# Altium schematic sheet DC_DC.SchDoc
size A4; SheetNumber: 1; SheetTotal: 1
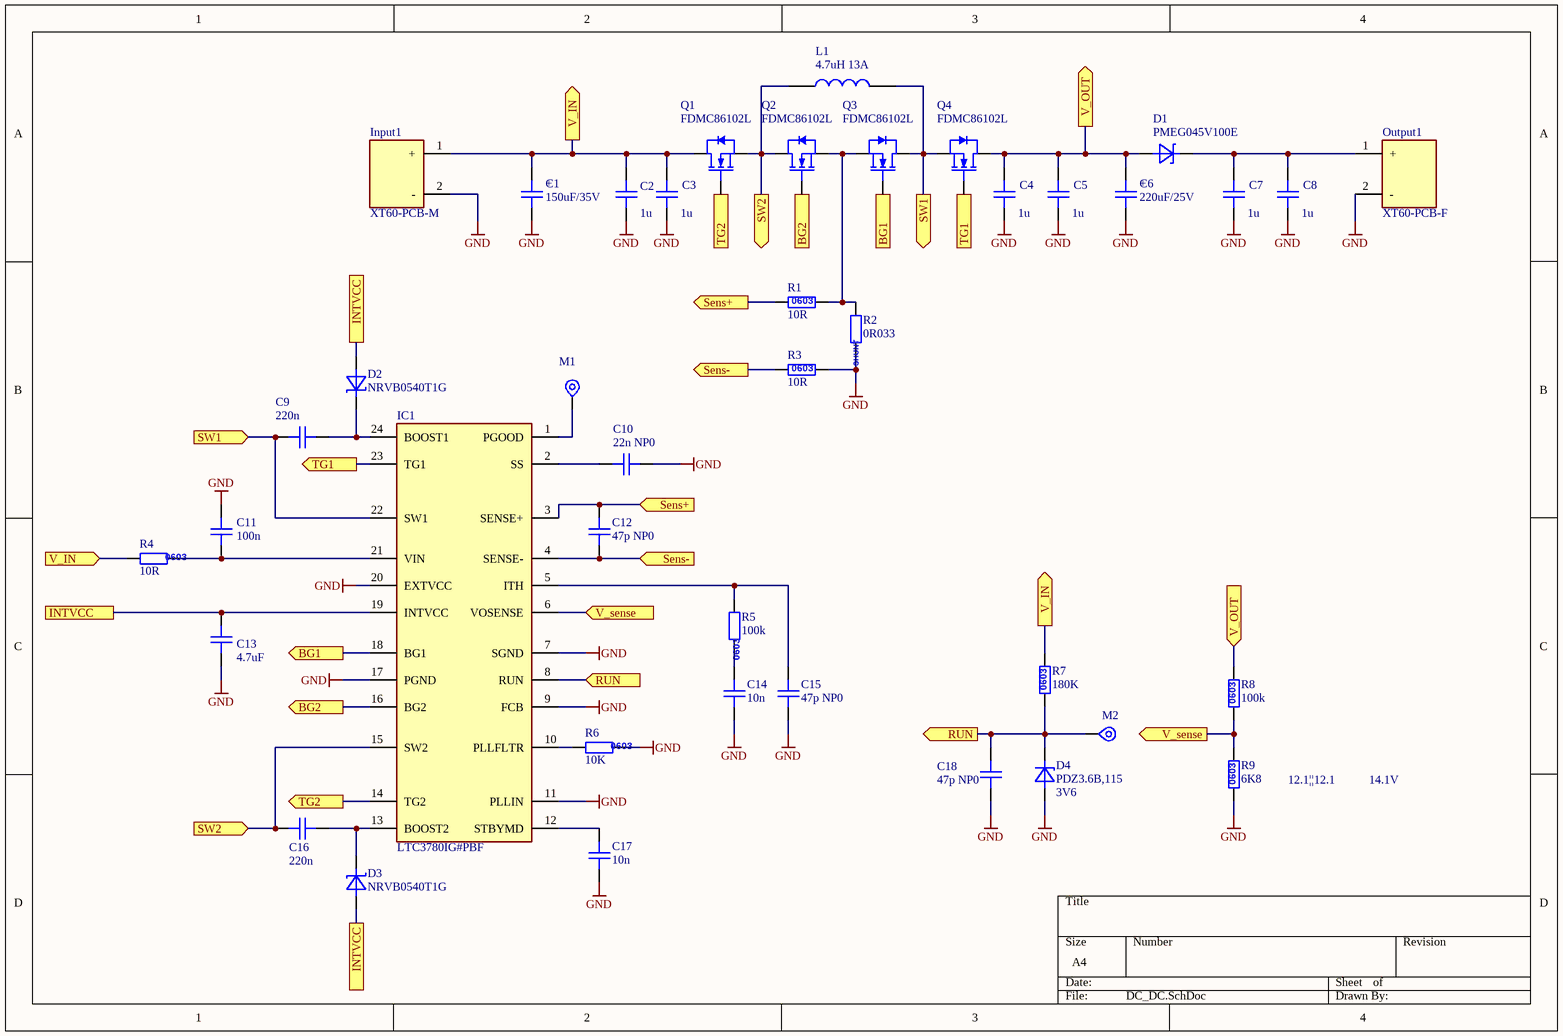
[diagram p0: DC_DC.SchDoc]

## Parts
C1  value 150uF/35V  [PZF8x9]  (hidden comment: 35PZE150M8X9)
C2  value 1u  [C1206_medium]  (hidden comment: C1206C105K5RACTU)
C3  value 1u  [C1206_medium]  (hidden comment: C1206C105K5RACTU)
C4  value 1u  [C1206_medium]  (hidden comment: C1206C105K5RACTU)
C5  value 1u  [C1206_medium]  (hidden comment: C1206C105K5RACTU)
C6  value 220uF/25V  [PZF8x9]  (hidden comment: 25PZF220M8X9)
C7  value 1u  [C1206_medium]  (hidden comment: C1206C105K5RACTU)
C8  value 1u  [C1206_medium]  (hidden comment: C1206C105K5RACTU)
C9  value 220n  [C1206_thin]  (hidden comment: C1206C224J1RACAUTO)
C10  value 22n NP0  [C0603]  (hidden comment: AC0603KRX7R9BB223)
C11  value 100n  [C1206_thin]  (hidden comment: GRT31C5C2A104JA12L)
C12  value 47p NP0  [C0603]  (hidden comment: GCM1885C2A470JA16J)
C13  value 4.7uF  [C1206_thick]  (hidden comment: GRM31CC72A475ME11L)
C14  value 10n  [C0603]  (hidden comment: C0603X103K1RAC3316)
C15  value 47p NP0  [C0603]  (hidden comment: GCM1885C2A470JA16J)
C16  value 220n  [C1206_thin]  (hidden comment: C1206C224J1RACAUTO)
C17  value 10n  [C0603]  (hidden comment: C0603X103K1RAC3316)
C18  value 47p NP0  [C0603]  (hidden comment: GCM1885C2A470JA16J)
D1  value PMEG045V100E  [SOT1289]  (hidden comment: PMEG045V100EIPE-QZ)
D2  NRVB0540T1G  [SOD323]
D3  NRVB0540T1G  [SOD323]
D4  PDZ3.6B,115  value 3V6  [SOD323]
IC1  LTC3780IG#PBF  [SOP65P780X200-24N]
Input1  XT60-PCB-M  [XT60-PCB-M]
L1  value 4.7uH 13A  [WE-HCI]  (hidden comment: 7443551470)
M1  TP  [Pad 1mm SMD]  (value not drawn)  (no BOM)
M2  TP  [Pad 1mm SMD]  (value not drawn)  (no BOM)
Output1  XT60-PCB-F  [XT60-PCB-F]
Q1  FDMC86102L  [PowerPak1212_LFPAK33]
Q2  FDMC86102L  [PowerPak1212_LFPAK33]
Q3  FDMC86102L  [PowerPak1212_LFPAK33]
Q4  FDMC86102L  [PowerPak1212_LFPAK33]
R1  value 10R  [R0603]  (hidden comment: CR0603-FX-10R0ELF)
R2  value 0R033  [Shunt_2512]  (hidden comment: GMR100HTBFMR033)
R3  value 10R  [R0603]  (hidden comment: CR0603-FX-10R0ELF)
R4  value 10R  [R0603]  (hidden comment: CR0603-FX-10R0ELF)
R5  value 100k  [R0603]  (hidden comment: RC0603FR-07100KL)
R6  value 10K  [R0603]  (hidden comment: CRGP0603F10K)
R7  value 180K  [R0603]  (hidden comment: CRGCQ0603F180K)
R8  value 100k  [R0603]  (hidden comment: RC0603FR-07100KL)
R9  value 6K8  [R0603]  (hidden comment: CRGCQ0603F6K8)

## Ports
BG1 (in, see DC_DC[1C]), BG1 (out, see DC_DC[3A]), BG2 (in, see DC_DC[1C]), BG2 (out, see DC_DC[3A]), INTVCC (see DC_DC[1B], DC_DC[1C]), INTVCC (see DC_DC[1B], DC_DC[1D]), INTVCC (see DC_DC[1C], DC_DC[1D]), RUN (in, see DC_DC[3C]), RUN (out, see DC_DC[2C]), Sens+ (in, see DC_DC[2B]), Sens+ (out, see DC_DC[2B]), Sens- (in, see DC_DC[2B]), Sens- (out, see DC_DC[2C]), SW1 (in, see DC_DC[3A]), SW1 (out, see DC_DC[1B]), SW2 (in, see DC_DC[2A]), SW2 (out, see DC_DC[1D]), TG1 (in, see DC_DC[1B]), TG1 (out, see DC_DC[3A]), TG2 (in, see DC_DC[1D]), TG2 (out, see DC_DC[2A]), V_IN (in, see DC_DC[2A], DC_DC[3C]), V_IN (out, see DC_DC[1C], DC_DC[2A]), V_IN (out, see DC_DC[1C], DC_DC[3C]), V_OUT (in, see DC_DC[3A]), V_OUT (out, see DC_DC[4C]), V_sense (in, see DC_DC[3C]), V_sense (out, see DC_DC[2C])

## Nets
GND: C1.2 C2.1 C3.1 C4.1 C5.1 C6.2 C7.1 C8.1 C10.1 C11.2 C13.2 C14.1 C15.1 C17.2 C18.1 D4.1(A) IC1.7(SGND) IC1.9(FCB) IC1.11(PLLIN) IC1.17(PGND) IC1.20(EXTVCC) Input1.2(-) Output1.2(-) R2.1 R3.1 R6.2 R9.2
BG1: IC1.18(BG1) Q3.4(GATE) ; port BG1
BG2: IC1.16(BG2) Q2.4(GATE) ; port BG2
INTVCC: C13.1 D2.1(A) D3.1(A) IC1.19(INTVCC) ; port INTVCC
RUN: C18.2 D4.2(C) IC1.8(RUN) M2.1 R7.2 ; port RUN
Sens+: C12.2 IC1.3(SENSE+) R1.2 ; port Sens+
Sens-: C12.1 IC1.4(SENSE-) R3.2 ; port Sens-
SW1: C9.2 IC1.22(SW1) L1.1 Q3.5(DRAIN) Q4.1,_2,_3(SOURCE) ; port SW1
SW2: C16.2 IC1.15(SW2) L1.2 Q1.1,_2,_3(SOURCE) Q2.5(DRAIN) ; port SW2
TG1: IC1.23(TG1) Q4.4(GATE) ; port TG1
TG2: IC1.14(TG2) Q1.4(GATE) ; port TG2
V_IN: C1.1 C2.2 C3.2 Input1.1(+) Q1.5(DRAIN) R4.1 R7.1 ; port V_IN
V_OUT: C4.2 C5.2 C6.1 D1.1,_2(A) Q4.5(DRAIN) R8.1 ; port V_OUT
V_sense: IC1.6(VOSENSE) R8.2 R9.1 ; port V_sense
NetC7_2: C7.2 C8.2 D1.3(K) Output1.1(+)
NetC9_1: C9.1 D2.2(C) IC1.24(BOOST1)
NetC10_2: C10.2 IC1.2(SS)
NetC11_1: C11.1 IC1.21(VIN) R4.2
NetC14_2: C14.2 R5.2
NetC15_2: C15.2 IC1.5(ITH) R5.1
NetC16_1: C16.1 D3.2(C) IC1.13(BOOST2)
NetC17_1: C17.1 IC1.12(STBYMD)
NetIC1_1: IC1.1(PGOOD) M1.1
NetIC1_10: IC1.10(PLLFLTR) R6.1
NetQ2_1, 2, 3: Q2.1,_2,_3(SOURCE) Q3.1,_2,_3(SOURCE) R1.1 R2.2

## Notes on the sheet
- 12.1||12.1
- 14.1V
- (in symbol CR_0603_100) 0603
- (in symbol CR_0603_103) 0603
- (in symbol CR_0603_104) 0603
- (in symbol CR_0603_184) 0603
- (in symbol CR_0603_682) 0603
- (in symbol EC_THT_157_polarised) +
- (in symbol EC_THT_227_polarised) +
- (in symbol SHUNT_2512_0R033) SHUNT

## Library data of the parts
C1 = EC_THT_157_polarised: High temp hybrid capacitor -55/125C; SMD/THD: THT; Main: Capacitors; Supplier 1: Mouser; Supplier 2: Digi-Key; Supplier Part Number 2: 35PZE150M8X9-ND; Supplier Part Number 1: 232-35PZE150M8X9; Category: Capacitors THT; Status: A; Component Type: Capacitors
C2-C5 C7 C8 = CC_1206_X7R_105: Ceramic Capacitor X7R 50V; Supplier 1: Mouser; Supplier 2: Digi-Key; Supplier 3: Farnell; Supplier Part Number 2: 490-5810-1-ND; Supplier Part Number 1: 81-GCJ31MR71H105KA2L; Supplier Part Number 3: 2781416
C6 = EC_THT_227_polarised: High temp hybrid capacitor -55/125C; SMD/THD: THT; Main: Capacitors; Supplier 1: Mouser; Supplier 2: Digi-Key; Supplier Part Number 2: 25PZF220M8X9-ND; Supplier Part Number 1: 232-25PZF220M8X9; Category: Capacitors THT; Status: A; Component Type: Capacitors
C9 C16 = CC_1206_X7R_224: Ceramic Capacitor X7R 100V; Supplier 1: Mouser; Supplier 2: Digi-Key; Supplier Part Number 2: 399-C1206C224J1RACAUTOCT-ND; Supplier Part Number 1: 80-C1206C224J1RAUTO
C10 = CC_0603_X7R_223: Ceramic Capacitor NP0 50V; Part Number: 22n/50V X7R C0603; Main: Capacitors; SMD/THD: SMD; Category: Capacitors CERA SMD; Status: A; Manufacturer Part Number: 22n/50V X7R C0603; Component Type: Capacitors; Supplier 1: Mouser; Supplier 2: Farnell; Supplier 3: Digi-Key; Supplier Part Number 3: 311-3119-6-ND; Supplier Part Number 2: 3368998; Supplier Part Number 1: 603-AC603KRX7R9BB223
C11 = CC_1206_NP0_104: Ceramic Capacitor NP0 100V; Supplier 1: Mouser; Supplier 2: Digi-Key; Supplier Part Number 1: 81-GRT31C5C2A104JA2L; Supplier Part Number 2: 490-GRT31C5C2A104JA12LDKR-ND
C12 C15 C18 = CC_0603_NP0_470: Ceramic Capacitor NP0 100V; SMD/THD: SMD; Main: Capacitors; Category: Capacitors CERA SMD; Status: A; ComponentLink1Description: datasheet; Component Type: Capacitors; Supplier 1: Mouser; Supplier Part Number 1: 81-GCM1885C2A470JA6J; Supplier 2: Farnell; Supplier Part Number 2: 3784365
C13 = CC_1206_X7S_475: Ceramic Capacitor X7S 100V; Supplier 1: Mouser; Supplier 2: Digi-Key; Supplier Part Number 1: 81-GRM31CC72A475ME11; Supplier Part Number 2: 490-18621-6-ND
C14 C17 = CC_0603_X7R_103: Ceramic Capacitor X7R 100V; Part Number: 10n/100V X7R C0603; SMD/THD: SMD; Main: Capacitors; Status: A; Category: Capacitors CERA SMD; Component Type: Capacitors; Supplier 1: Mouser; Supplier 2: Digi-Key; Supplier 3: Farnell; Supplier 4: TME; Supplier Part Number 1: 80-C0603X103K1R3316; Supplier Part Number 2: 399-C0603X103K1RAC3316CT-ND; Supplier Part Number 3: 2666889; Supplier Part Number 4: C0603X103K1RAC3316
D1 = PMEG045V100E: Planar Low VF Schottky barrier rectifier 45V/10A; Part Number: PMEG4005AEA; Manufacturer: NXP; SMD/THD: SMD; Main: Diodes; ComponentLink1URL: http://www.farnell.com/datasheets/684565.pdf; ComponentLink1Description: Datasheet; Category: Schottky; Status: A; Supplier 1: Mouser; Supplier 2: Digi-Key; Supplier 3: Farnell; Supplier Part Number 1: 771-PMEG4005AESFYL; Supplier Part Number 2: 1727-2295-1-ND; Supplier Part Number 3: 2498560
D2 D3 = NRVB0540T1G: Schottky Diode 40V, 500mA; SMD/THD: SMD; Main: Diodes; Value: NRVB0540T1G; Category: Schottky; Status: A; Supplier 1: Mouser; Supplier Part Number 1: 863-NRVB0540T1G; Supplier 2: Farnell; Supplier Part Number 2: 2723913
D4 = PDZ3.6B,115: Zener Diode 3.6V, 400mW; SMD/THD: SMD; Main: Diodes; Category: Zener; Status: A; Supplier 1: Mouser; Supplier Part Number 1: 771-PDZ36B8115; Supplier 2: TME; Supplier Part Number 2: PDZ3.6B.115
IC1 = LTC3780IG#PBF: DC/DC Buck-Boost; Manufacturer_Name: Analog Devices; Height: 2mm; Manufacturer_Part_Number: LTC3780IG#PBF; Supplier 1: Mouser; Supplier 2: TME; Supplier Part Number 2: LTC3780IGPBF; Supplier Part Number 1: 584-LTC3780IG#PBF
Input1 = XT60-PCB-M: XT60 Connector; Manufacturer_Name: Amass; Manufacturer_Part_Number: XT30PB; Datasheet Link: https://www.tme.eu/Document/4acc913878197f8c2e30d4b8cdc47230/XT30UPB%20SPEC.pdf; Height: 10.7mm
L1 = WE-HCI High Current 4.7uH-13A: WE-HCI SMT High Current Inductor 4.7uH 20% 100kHz Ferrite 13A SMD T/R / Frequency - Self Resonant 30MHz; Supplier 1: Digikey; Supplier Part Number 1: 732-7443551470CT-ND; Supplier 2: Mouser; Supplier Part Number 2: 710-7443551470
M1 M2 = TP_PCB: Test Point; Main: Mechanical; Category: Pads_Pins_Measure_Points; Stock number: --------; Component Type: Mechanical
Output1 = XT60-PCB-F: XT60 Connector; Manufacturer_Name: Amass; Manufacturer_Part_Number: XT30PB; Datasheet Link: https://www.tme.eu/Document/4acc913878197f8c2e30d4b8cdc47230/XT30UPB%20SPEC.pdf; Height: 10.7mm
Q1-Q4 = FDMC86102L: Single N-Channel 100V, 18A, 23mOhm; Manufacturer: ON Semiconductor / Fairchild; Main: Transistors; SMD/THD: SMD; Category: N-MOS; Value: FDMC86102L; ComponentLink1Description: Datasheet; ComponentLink1URL: http://www.farnell.com/datasheets/1837750.pdf; Status: A; Part Number: FDMC86102L; Manufacturer Part Number: FDMC86102L; Component Type: Transistors; Supplier 1: Mouser; Supplier Part Number 1: 512-FDMC86102L; Supplier 2: Digi-Key; Supplier Part Number 2: FDMC86102LFSCT-ND
R1 R3 R4 = CR_0603_100: Resistor 1%, 0.1W, 75V; SMD/THD: SMD; Main: Resistors; Status: A; Category: Resistors SMD; Component Type: Resistors; Supplier 1: Mouser; Supplier 2: Farnell; Supplier 3: Digi-Key; Supplier Part Number 2: 2321756; Supplier Part Number 1: 652-CR0603FX-10R0ELF; Supplier Part Number 3: CR0603-FX-10R0ELFDKR-ND
R2 = SHUNT_2512_0R033: Current Sense Resistor 1%, 3W, AEC-Q200; SMD/THD: SMD; Main: Resistors; Status: A; Category: Resistors SMD; Component Type: Resistors; Supplier 1: Mouser; Supplier Part Number 1: 755-GMR100HTBFMR033; Supplier 2: Digi-Key; Supplier Part Number 2: 511-1690-1-ND; Supplier 3: Farnell; Supplier Part Number 3: 2808333
R5 = CR_0603_104: Resistor 1%, 0.1W, 75V; SMD/THD: SMD; Main: Resistors; Status: A; Category: Resistors SMD; Component Type: Resistors; Supplier 1: Mouser; Supplier 2: Farnell; Supplier 3: TME; Supplier Part Number 2: 9238727; Supplier Part Number 1: 603-RC0603FR-07100KL; Supplier Part Number 3: RC0603FR-07100K
R6 = CR_0603_103: Resistor 1%, 0.1W, 75V; SMD/THD: SMD; Main: Resistors; Status: A; Category: Resistors SMD; Component Type: Resistors; Supplier 1: Mouser; Supplier 2: Digi-Key; Supplier 3: Farnell; Supplier Part Number 3: 2861046; Supplier Part Number 2: A130428CT-ND; Supplier Part Number 1: 279-CRGP0603F10K
R7 = CR_0603_184: Resistor 1%, 0.1W, 75V; SMD/THD: SMD; Main: Resistors; Status: A; Category: Resistors SMD; Component Type: Resistors; Supplier 1: Mouser; Supplier Part Number 1: 279-CRGCQ0603F180K; Supplier 2: Digi-Key; Supplier Part Number 2: A129715CT-ND; Supplier 3: Farnell; Supplier Part Number 3: 2861488
R8 = CR_0603_104: Resistor 1%, 0.1W, 75V; Main: Resistors; SMD/THD: SMD; Category: Resistors SMD; Status: A; Component Type: Resistors; Supplier 1: Mouser; Supplier 2: Farnell; Supplier 3: TME; Supplier Part Number 1: 603-RC0603FR-07100KL; Supplier Part Number 2: 9238727; Supplier Part Number 3: RC0603FR-07100K
R9 = CR_0603_682: Resistor 1%, 0.1W, 75V; Main: Resistors; SMD/THD: SMD; Category: Resistors SMD; Status: A; Component Type: Resistors; Supplier 1: Mouser; Supplier 2: Digi-Key; Supplier 3: Farnell; Supplier Part Number 1: 279-CRGCQ0603F6K8; Supplier Part Number 2: A129698CT-ND; Supplier Part Number 3: 2861471